# Altium schematic sheet Digital.SchDoc
size A4
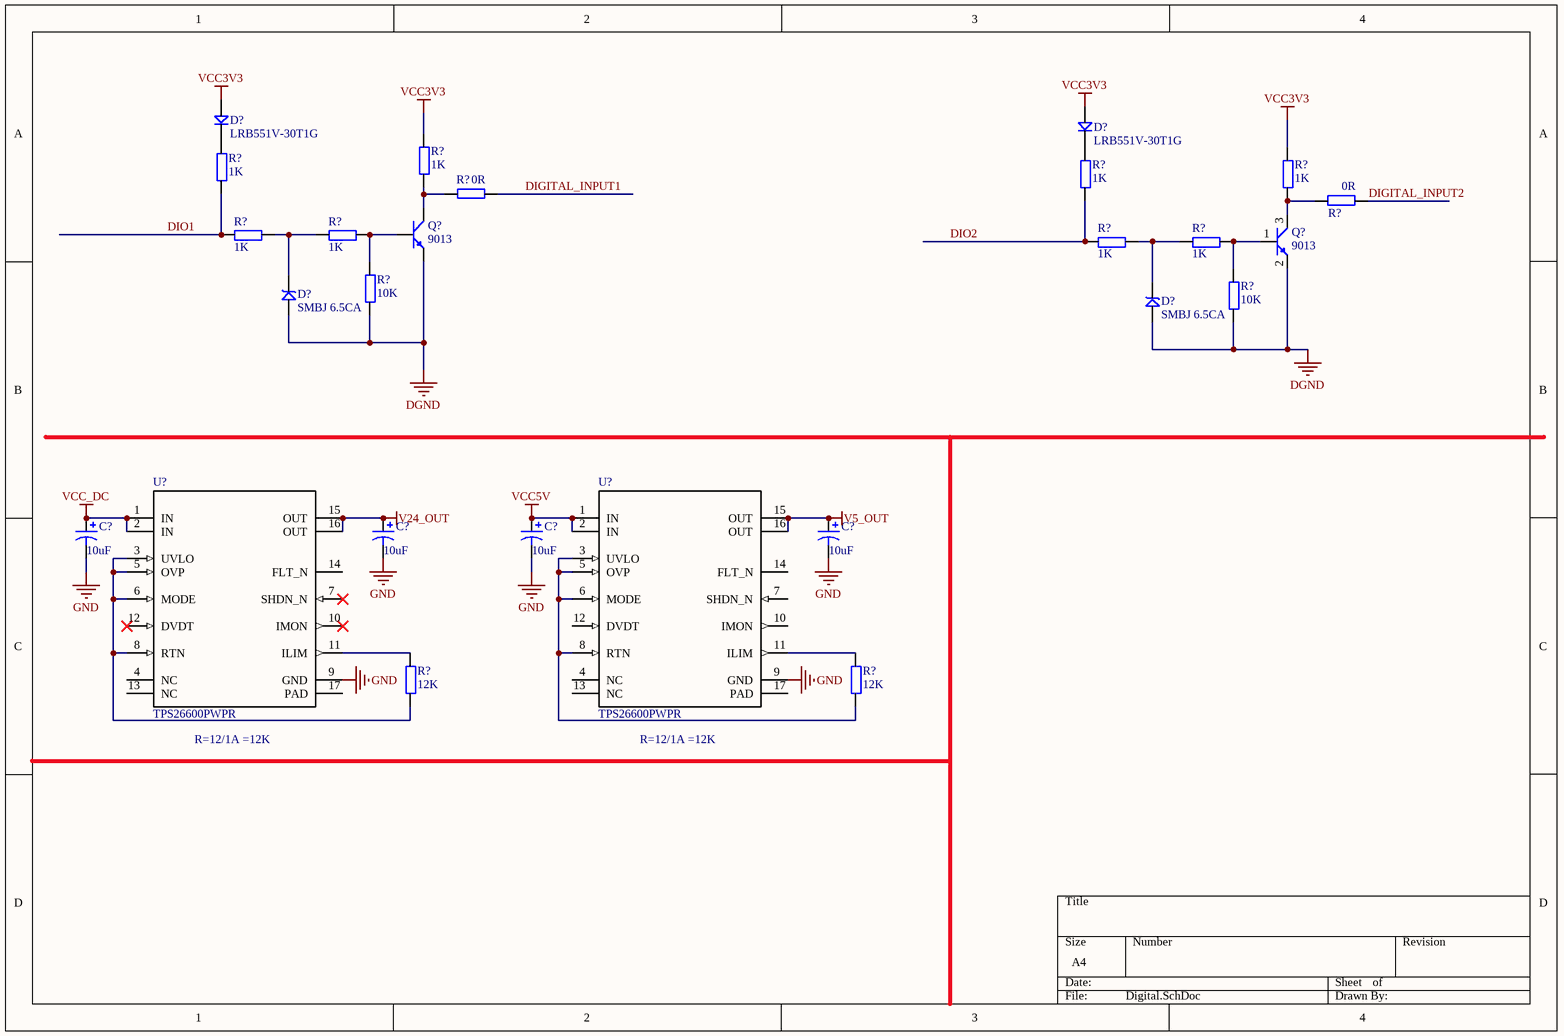
[diagram p0: Digital.SchDoc]

## Parts
(Parts that share a designator on the sheet are numbered #1, #2 ... from top to bottom, then left to right.)
C?#1  value 10uF  [CAP-3216]  (hidden comment: Cap Pol3)
C?#2  value 10uF  [CAP-3216]  (hidden comment: Cap Pol3)
C?#3  value 10uF  [CAP-3216]  (hidden comment: Cap Pol3)
C?#4  value 10uF  [CAP-3216]  (hidden comment: Cap Pol3)
D?#1  LRB551V-30T1G  [SOD-323]
D?#2  LRB551V-30T1G  [SOD-323]
D?#3  SMBJ 6.5CA  [DO-214AA]
D?#4  SMBJ 6.5CA  [DO-214AA]
Q?#1  9013  [SOT-23]
Q?#2  9013  [SOT-23]
R?#1  1K  [0603]
R?#2  1K  [0603]
R?#3  1K  [0603]
R?#4  1K  [0603]
R?#5  1K  [0603]
R?#6  1K  [0603]
R?#7  1K  [0603]
R?#8  1K  [0603]
R?#9  0R  [0603]
R?#10  0R  [0603]
R?#11  10K  [0603]
R?#12  10K  [0603]
R?#13  12K  [0603]
R?#14  12K  [0603]
U?#1  TPS26600PWPR  [PWP0016H_N]
U?#2  TPS26600PWPR  [PWP0016H_N]

## Nets
DGND: D?#3.1 D?#4.1 Q?#1.2(E) Q?#2.2(E) R?#11.1 R?#12.1
GND: C?#1.2 C?#2.2 C?#3.2 C?#4.2 U?#1.9(GND) U?#2.9(GND)
V5_OUT: C?#4.1 U?#2.15(OUT) U?#2.16(OUT)
V24_OUT: C?#2.1 U?#1.15(OUT) U?#1.16(OUT)
VCC3V3: D?#1.2 D?#2.2 R?#1.2 R?#4.2
VCC5V: C?#3.1 U?#2.1(IN) U?#2.2(IN)
VCC_DC: C?#1.1 U?#1.1(IN) U?#1.2(IN)
DIGITAL_INPUT1: R?#9.1
DIGITAL_INPUT2: R?#10.1
DIO1: R?#2.1 R?#5.1
DIO2: R?#3.1 R?#7.1
NetD?#1_1: D?#1.1 R?#2.2
NetD?#2_1: D?#2.1 R?#3.2
NetD?#3_2: D?#3.2 R?#5.2 R?#6.1
NetD?#4_2: D?#4.2 R?#7.2 R?#8.1
NetQ?#1_1: Q?#1.1(B) R?#6.2 R?#11.2
NetQ?#1_3: Q?#1.3(C) R?#1.1 R?#9.2
NetQ?#2_1: Q?#2.1(B) R?#8.2 R?#12.2
NetQ?#2_3: Q?#2.3(C) R?#4.1 R?#10.2
NetR?#13_1: R?#13.1 U?#1.3(UVLO) U?#1.5(OVP) U?#1.6(MODE) U?#1.8(RTN)
NetR?#13_2: R?#13.2 U?#1.11(ILIM)
NetR?#14_1: R?#14.1 U?#2.3(UVLO) U?#2.5(OVP) U?#2.6(MODE) U?#2.8(RTN)
NetR?#14_2: R?#14.2 U?#2.11(ILIM)

Not connected (* = marked no-connect by the designer): U?#1 4(NC) 7(SHDN_N)* 10(IMON)* 12(DVDT)* 13(NC) 14(FLT_N) 17(PAD); U?#2 4(NC) 7(SHDN_N) 10(IMON) 12(DVDT) 13(NC) 14(FLT_N) 17(PAD)

## Notes on the sheet
- (near U?#1) R=12/1A =12K
- (near U?#2) R=12/1A =12K

## Library data of the parts
C?#1-C?#4 = Cap Pol3: Polarized Capacitor (Surface Mount); Published: 8-Jun-2000; LatestRevisionDate: 29-May-2009; LatestRevisionNote: IPC-7351 Footprint Added.; PackageReference: C0805; Publisher: Altium Limited; PackageDescription: Chip Capacitor
D?#1 D?#2 = D_DIODE LRB: LRB551V-30T1G  20V  0.5A 肖特基二极管; MAN: LRC; TPN: 1D-0000013-XX; MPN: LRB551V-30T1G
D?#3 D?#4 = SMBJ 6.5CA: TVS,SMBJ 6.5CA,600W SMD Transient Voltage Suppressor Diodes,; Terabits Part Number: 1D-0000001-XX; Manufacture: LRC; Part Type: Diode; Manufacture Part Number: SMBJ 6.5CA
Q?#1 Q?#2 = L2SC4617RT1G: Manufacture: LRC; Terabits Part Number: 1Q-0000001-XX; Part Type: Audion; Manufacture Part Number: L2SC4617RT1G
R?#1 R?#4 R?#6 R?#8 R?#11 R?#12 = R_1K: Res,1K,0603; Terabits Part Number: 1R-0000008-XX; Part Type: RES 0603
R?#2 R?#3 R?#5 R?#7 = R_1K: Res,1K,0603; TPN: 1R-0000008-XX
R?#9 R?#10 R?#13 R?#14 = R
U?#1 U?#2 = TPS26600PWPR: Imported; Manufacturer: Texas Instruments; PartNumber: TPS26600PWPR; RefDes: RefDes; TYPE: TYPE; Value: Value